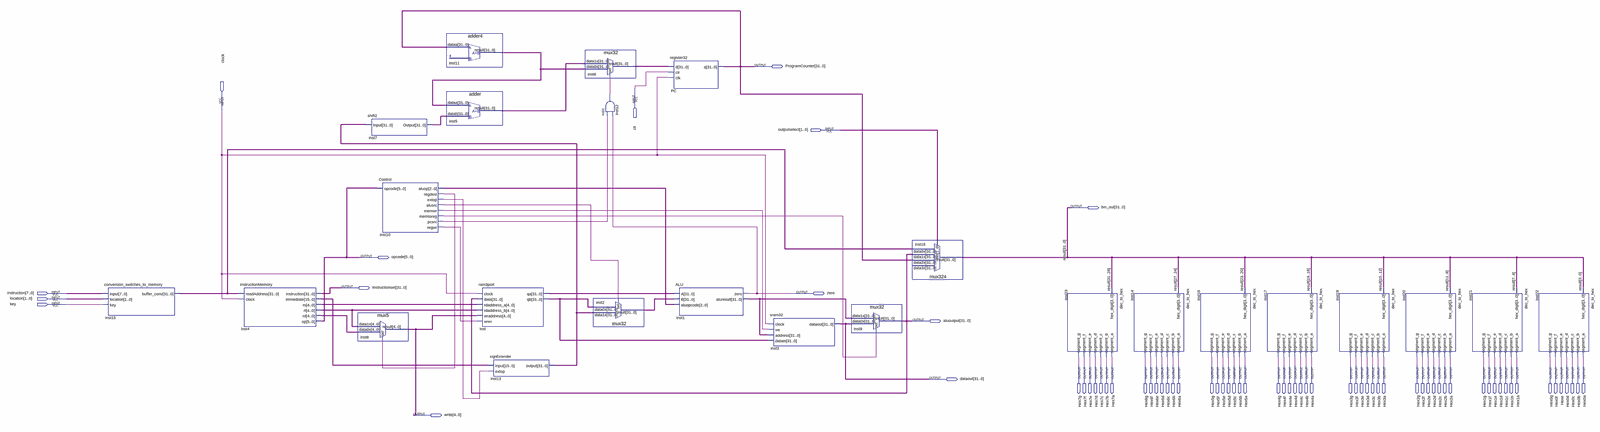
[diagram p0: schematic sheet, whole]
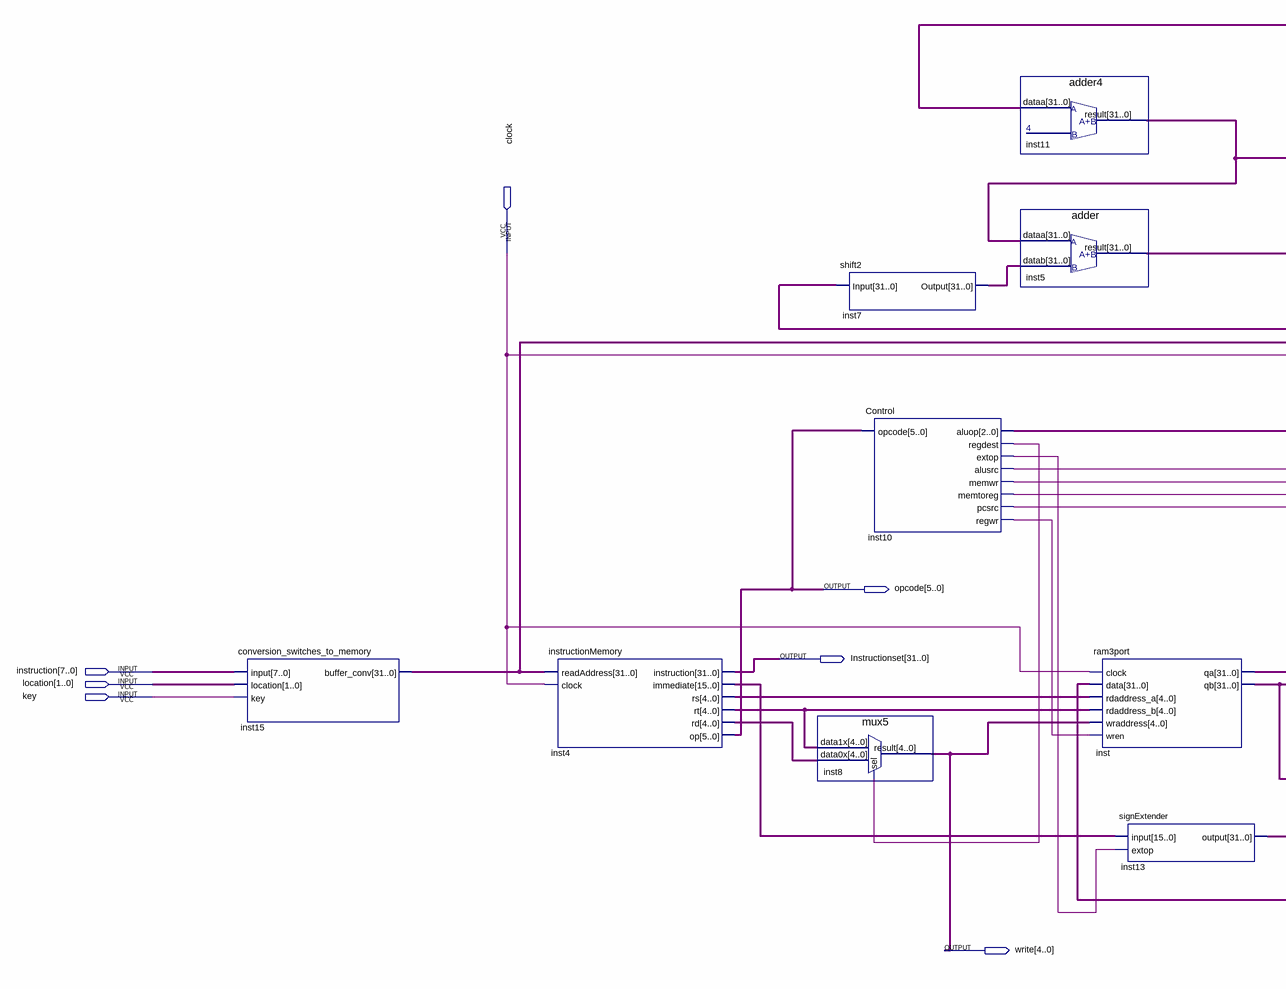
[diagram p1: schematic sheet, left part]
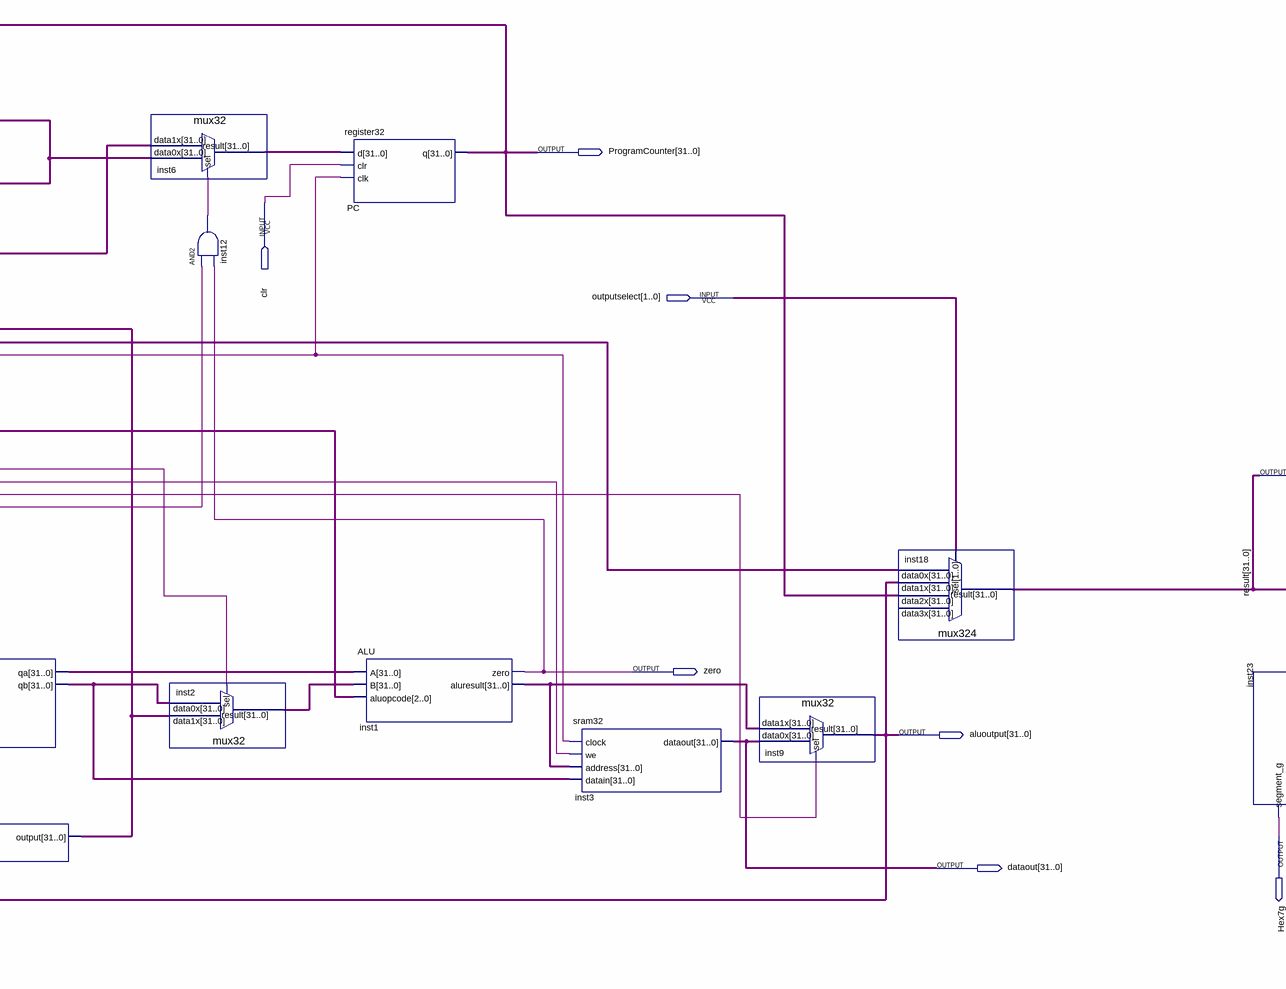
[diagram p2: schematic sheet, centre part]
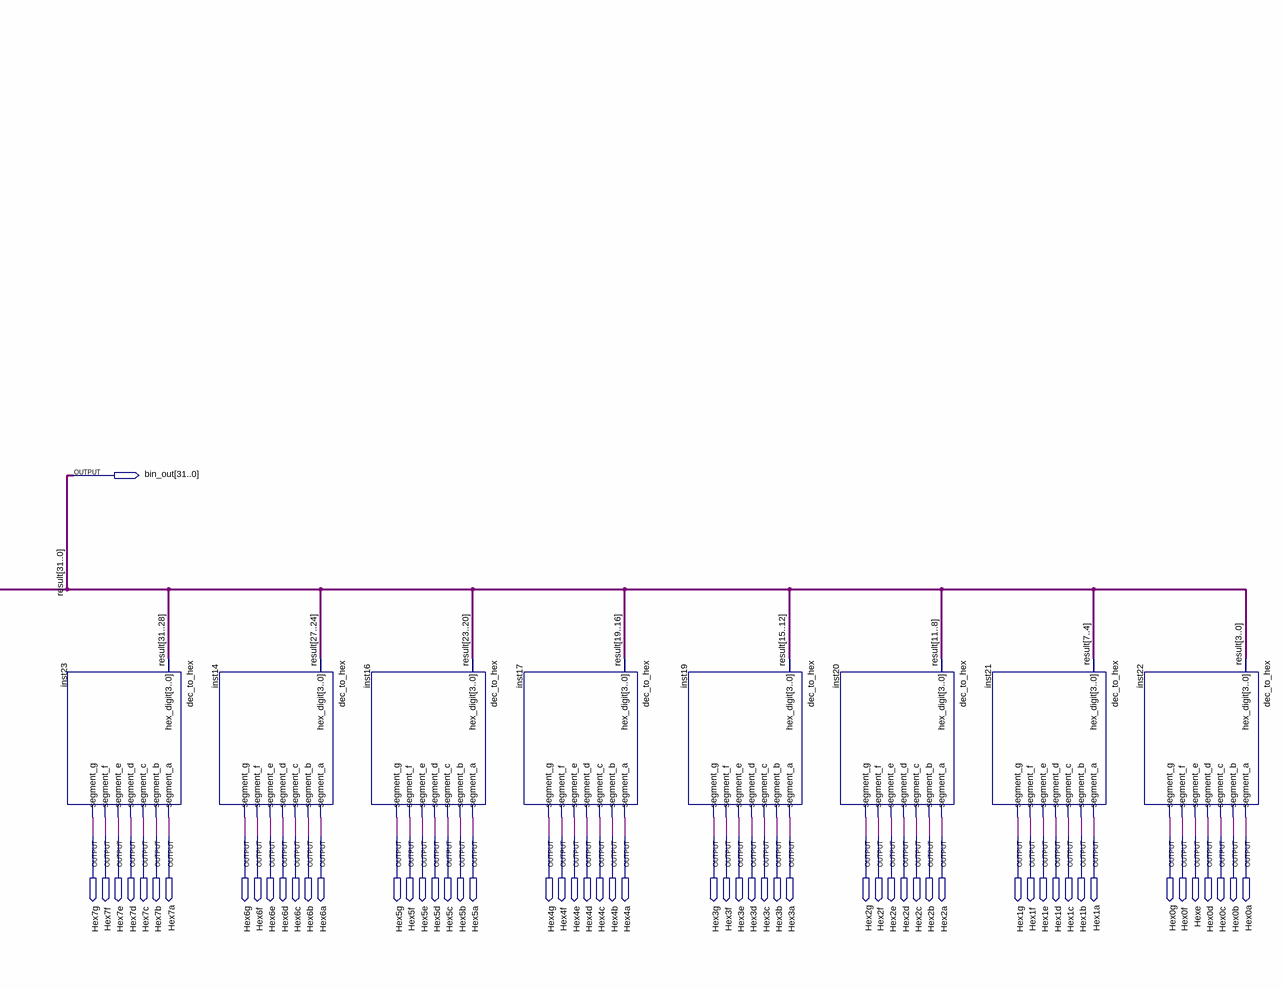
[diagram p3: schematic sheet, right part]
// Quartus schematic CPUforDE2.bdf as structural Verilog: 25 symbols, 70 pins
module CPUforDE2 (
  input  clr,
  input  clock,
  input  [1:0] outputselect,
  input  [7:0] instruction,
  input  [1:0] location,
  input  key,
  output [31:0] ProgramCounter,
  output [31:0] bin_out,
  output [5:0] opcode,
  output [31:0] Instructionset,
  output zero,
  output [31:0] aluoutput,
  output Hex7g,
  output Hex7f,
  output Hex7e,
  output Hex7d,
  output Hex7c,
  output Hex7b,
  output Hex7a,
  output Hex6g,
  output Hex6f,
  output Hex6e,
  output Hex6d,
  output Hex6c,
  output Hex6b,
  output Hex6a,
  output Hex5g,
  output Hex5f,
  output Hex5e,
  output Hex5d,
  output Hex5c,
  output Hex5b,
  output Hex5a,
  output Hex4g,
  output Hex4f,
  output Hex4e,
  output Hex4d,
  output Hex4c,
  output Hex4b,
  output Hex4a,
  output Hex3g,
  output Hex3f,
  output Hex3e,
  output Hex3d,
  output Hex3c,
  output Hex3b,
  output Hex3a,
  output Hex2g,
  output Hex2f,
  output Hex2e,
  output Hex2d,
  output Hex2c,
  output Hex2b,
  output Hex2a,
  output Hex1g,
  output Hex1f,
  output Hex1e,
  output Hex1d,
  output Hex1c,
  output Hex1b,
  output Hex1a,
  output Hex0g,
  output Hex0f,
  output Hexe,
  output Hex0d,
  output Hex0c,
  output Hex0b,
  output Hex0a,
  output [31:0] dataout,
  output [4:0] write
);

  wire inst10_alusrc, inst10_extop, inst10_memtoreg, inst10_memwr, inst10_pcsrc, inst10_regdest,
       inst10_regwr, inst12_out;
  wire [2:0] inst10_aluop;
  wire [4:0] inst4_rd, inst4_rs, inst4_rt;
  wire [15:0] inst4_immediate;
  wire [31:0] aluresult, inst2_result, inst5_result, inst6_result, inst7_output, inst11_result,
       inst13_output, inst15_buffer_conv, inst_qa, inst_qb;

  conversion_switches_to_memory inst15 (
    .\input (instruction), .location(location), .key(key), .buffer_conv(inst15_buffer_conv));
  instructionMemory inst4 (
    .readAddress(inst15_buffer_conv), .clock(clock), .instruction(Instructionset),
    .immediate(inst4_immediate), .rs(inst4_rs), .rt(inst4_rt), .rd(inst4_rd), .op(opcode));
  shift2 inst7 (.Input(inst13_output), .Output(inst7_output));
  mux5 inst8 (.data1x(inst4_rt), .data0x(inst4_rd), .sel(inst10_regdest), .result(write));
  Control inst10 (
    .opcode(opcode), .aluop(inst10_aluop), .regdest(inst10_regdest), .extop(inst10_extop),
    .alusrc(inst10_alusrc), .memwr(inst10_memwr), .memtoreg(inst10_memtoreg), .pcsrc(inst10_pcsrc),
    .regwr(inst10_regwr));
  adder4 inst11 (.dataa(ProgramCounter), .result(inst11_result));
  adder inst5 (.dataa(inst11_result), .datab(inst7_output), .result(inst5_result));
  ram3port inst (
    .clock(clock), .data(aluoutput), .rdaddress_a(inst4_rs), .rdaddress_b(inst4_rt), .wraddress(write),
    .wren(inst10_regwr), .qa(inst_qa), .qb(inst_qb));
  signExtender inst13 (.\input (inst4_immediate), .extop(inst10_extop), .\output (inst13_output));
  mux32 inst6 (.data1x(inst5_result), .data0x(inst11_result), .sel(inst12_out), .result(inst6_result));
  and inst12 (inst12_out, inst10_pcsrc, zero);
  mux32 inst2 (.data1x(inst13_output), .data0x(inst_qb), .sel(inst10_alusrc), .result(inst2_result));
  register32 PC (.d(inst6_result), .clr(clr), .clk(clock), .q(ProgramCounter));
  ALU inst1 (.A(inst_qa), .B(inst2_result), .aluopcode(inst10_aluop), .zero(zero), .aluresult(aluresult));
  sram32 inst3 (.clock(clock), .we(inst10_memwr), .address(aluresult), .datain(inst_qb), .dataout(dataout));
  mux32 inst9 (.data1x(aluresult), .data0x(dataout), .sel(inst10_memtoreg), .result(aluoutput));
  mux324 inst18 (
    .data2x(ProgramCounter), .data1x(aluoutput), .data0x(inst15_buffer_conv), .sel(outputselect),
    .result(bin_out));  // open: data3x
  dec_to_hex inst23 (
    .hex_digit(bin_out[31:28]), .segment_a(Hex7a), .segment_b(Hex7b), .segment_c(Hex7c), .segment_d(Hex7d),
    .segment_e(Hex7e), .segment_f(Hex7f), .segment_g(Hex7g));
  dec_to_hex inst14 (
    .hex_digit(bin_out[27:24]), .segment_a(Hex6a), .segment_b(Hex6b), .segment_c(Hex6c), .segment_d(Hex6d),
    .segment_e(Hex6e), .segment_f(Hex6f), .segment_g(Hex6g));
  dec_to_hex inst16 (
    .hex_digit(bin_out[23:20]), .segment_a(Hex5a), .segment_b(Hex5b), .segment_c(Hex5c), .segment_d(Hex5d),
    .segment_e(Hex5e), .segment_f(Hex5f), .segment_g(Hex5g));
  dec_to_hex inst17 (
    .hex_digit(bin_out[19:16]), .segment_a(Hex4a), .segment_b(Hex4b), .segment_c(Hex4c), .segment_d(Hex4d),
    .segment_e(Hex4e), .segment_f(Hex4f), .segment_g(Hex4g));
  dec_to_hex inst19 (
    .hex_digit(bin_out[15:12]), .segment_a(Hex3a), .segment_b(Hex3b), .segment_c(Hex3c), .segment_d(Hex3d),
    .segment_e(Hex3e), .segment_f(Hex3f), .segment_g(Hex3g));
  dec_to_hex inst20 (
    .hex_digit(bin_out[11:8]), .segment_a(Hex2a), .segment_b(Hex2b), .segment_c(Hex2c), .segment_d(Hex2d),
    .segment_e(Hex2e), .segment_f(Hex2f), .segment_g(Hex2g));
  dec_to_hex inst21 (
    .hex_digit(bin_out[7:4]), .segment_a(Hex1a), .segment_b(Hex1b), .segment_c(Hex1c), .segment_d(Hex1d),
    .segment_e(Hex1e), .segment_f(Hex1f), .segment_g(Hex1g));
  dec_to_hex inst22 (
    .hex_digit(bin_out[3:0]), .segment_a(Hex0a), .segment_b(Hex0b), .segment_c(Hex0c), .segment_d(Hex0d),
    .segment_e(Hexe), .segment_f(Hex0f), .segment_g(Hex0g));

  // Other names for the same wires on the sheet: result[31:0] = bin_out; q[31:0] = ProgramCounter
endmodule
